# EAGLE design ABoatMon (EAGLE 9.3.0)
CNAME: MoteinoMega ABoatMon Shield; CREVISION: 0.959; DESIGNER: gregcope@gmail.com
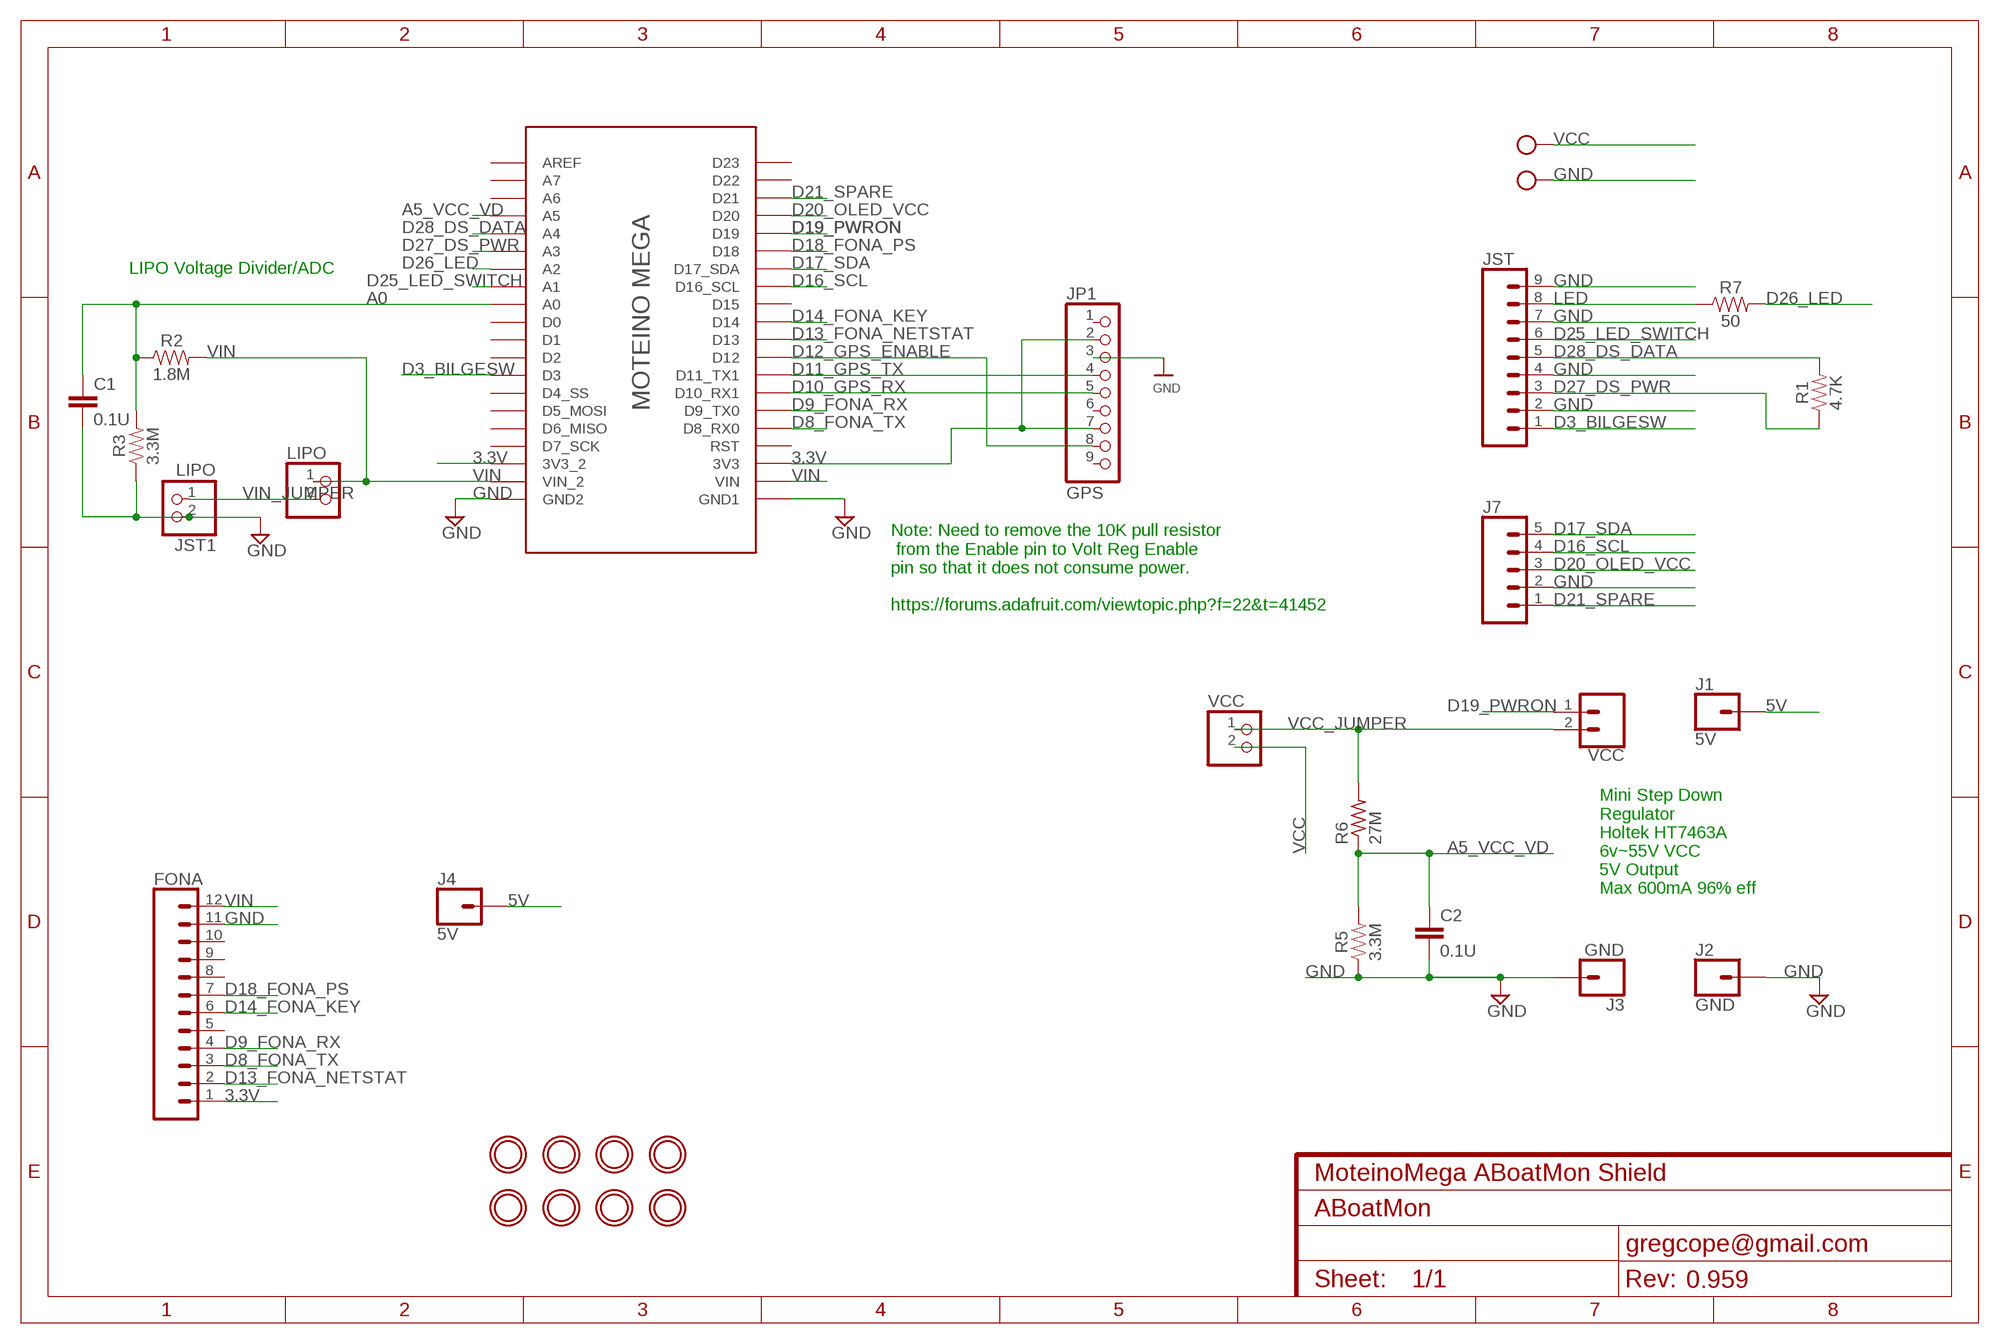
[diagram p0: schematic, sheet 1]

## Parts
C1  0.1U  0.1UF-KIT-EZ-50V-20%  [CAP-PTH-SMALL-KIT]
C2  0.1U  0.1UF-KIT-EZ-50V-20%  [CAP-PTH-SMALL-KIT]
ENABLE  VCC  CONN_02  [1X02]
FONA  CONN_12  [1X12]
GND  MOUNTINGHOLE2.5  [MOUNTINGHOLE_2.5_PLATED]
J1  5V  CONN_01  [1X01]
J2  GND  CONN_01  [1X01]
J3  GND  CONN_01  [1X01]
J4  5V  CONN_01  [1X01]
J7  CONN_05NO_SILK  [1X05_NO_SILK]
JP1  GPS  HEADER-1X970MIL  [1X09_ROUND_70]
JST  CONN_09  [1X09]
JST1  LIPO  JST_2PIN-THM  [JST-PH-2-THM]
LIPO  HEADER-1X2ROUND  [1X02_ROUND]
MOTEINO_MEGA  HEADERS  MOTEINO_MEGA_SIMPLE  [MOTEINO_MEGA_SIMPLE]
R1  4.7K  1KOHM-HORIZ-1/4W-1%  [AXIAL-0.3]
R2  1.8M  1KOHM-HORIZ-1/4W-1%  [AXIAL-0.3]
R3  3.3M  1KOHM-HORIZ-1/4W-1%  [AXIAL-0.3]
R5  3.3M  1KOHM-HORIZ-1/4W-1%  [AXIAL-0.3]
R6  27M  R-US_0309/12  [0309/12]
R7  50  1KOHM-HORIZ-1/4W-1%  [AXIAL-0.3]
U$1  MOUNTINGHOLE2.5  [MOUNTINGHOLE_2.5_PLATED]
U$2  MOUNTINGHOLE2.5  [MOUNTINGHOLE_2.5_PLATED]
U$3  MOUNTINGHOLE2.5  [MOUNTINGHOLE_2.5_PLATED]
U$4  MOUNTINGHOLE2.5  [MOUNTINGHOLE_2.5_PLATED]
U$5  MOUNTINGHOLE2.5  [MOUNTINGHOLE_2.5_PLATED]
U$7  MOUNTINGHOLE2.5  [MOUNTINGHOLE_2.5_PLATED]
U$8  MOUNTINGHOLE2.5  [MOUNTINGHOLE_2.5_PLATED]
VCC  HEADER-1X2ROUND  [1X02_ROUND]
X1  MKDSN1,5/2-5,08  [MKDSN1,5/2-5,08]

## Nets
3.3V [power]: FONA.1 JP1.2 JP1.7 MOTEINO_MEGA.3V3 MOTEINO_MEGA.3V3_2
5V [power]: J1.1 J4.1
A0: C1.1 MOTEINO_MEGA.A0 R2.P$1 R3.P$2
A5_VCC_VD: C2.1 MOTEINO_MEGA.A5 R5.P$2 R6.1
D3_BILGESW: JST.1 MOTEINO_MEGA.D3
D8_FONA_TX: FONA.3 MOTEINO_MEGA.D8(D8_RX0)
D9_FONA_RX: FONA.4 MOTEINO_MEGA.D9(D9_TX0)
D10_GPS_RX: JP1.5 MOTEINO_MEGA.D10(D10_RX1)
D11_GPS_TX: JP1.4 MOTEINO_MEGA.D11(D11_TX1)
D12_GPS_ENABLE: JP1.8 MOTEINO_MEGA.D12
D13_FONA_NETSTAT: FONA.2 MOTEINO_MEGA.D13
D14_FONA_KEY: FONA.6 MOTEINO_MEGA.D14
D16_SCL: J7.4 MOTEINO_MEGA.D16(D16_SCL)
D17_SDA: J7.5 MOTEINO_MEGA.D17(D17_SDA)
D18_FONA_PS: FONA.7 MOTEINO_MEGA.D18
D19_PWRON: ENABLE.1 MOTEINO_MEGA.D19
D20_OLED_VCC: J7.3 MOTEINO_MEGA.D20
D21_SPARE: J7.1 MOTEINO_MEGA.D21
D25_LED_SWITCH: JST.6 MOTEINO_MEGA.A1
D26_LED: MOTEINO_MEGA.A2 R7.P$2
D27_DS_PWR: JST.3 MOTEINO_MEGA.A3 R1.P$1
D28_DS_DATA: JST.5 MOTEINO_MEGA.A4 R1.P$2
GND [power]: C1.2 C2.2 FONA.11 J2.1 J3.1 J7.2 JP1.3 JST1.2 JST.2 JST.4 JST.7 JST.9 MOTEINO_MEGA.GND1 MOTEINO_MEGA.GND_2(GND2) R3.P$1 R5.P$1 X1.2
LED: JST.8 R7.P$1
VCC [power]: VCC.2 X1.1
VCC_JUMPER [power]: ENABLE.2 R6.2 VCC.1
VIN [power]: FONA.12 LIPO.1 MOTEINO_MEGA.VIN MOTEINO_MEGA.VIN_2 R2.P$2
VIN_JUMPER [power]: JST1.1 LIPO.2
Unconnected: FONA.5 FONA.8 FONA.9 FONA.10 JP1.1 JP1.6 JP1.9 MOTEINO_MEGA.A6 MOTEINO_MEGA.A7 MOTEINO_MEGA.AREF MOTEINO_MEGA.D0 MOTEINO_MEGA.D1 MOTEINO_MEGA.D2 MOTEINO_MEGA.D4(D4_SS) MOTEINO_MEGA.D5(D5_MOSI) MOTEINO_MEGA.D6(D6_MISO) MOTEINO_MEGA.D7(D7_SCK) MOTEINO_MEGA.D15 MOTEINO_MEGA.D22 MOTEINO_MEGA.D23 MOTEINO_MEGA.RST

## Notes on the sheet
- LIPO Voltage Divider/ADC
- Note: Need to remove the 10K pull resistor
   from the Enable pin to Volt Reg Enable 
  pin so that it does not consume power.
  
  https://forums.adafruit.com/viewtopic.php?f=22&t=41452
- Mini Step Down 
  Regulator
  Holtek HT7463A
  6v~55V VCC
  5V Output
  Max 600mA 96% eff

## Library data of the parts
C1 C2 = SparkFun-Capacitors:0.1UF: 0.1µF ceramic capacitors A capacitor is a passive two-terminal electrical component used to store electrical energy temporarily in an electric field.; PROD_ID: CAP-08370; VALUE: 0.1uF
ENABLE = SparkFun-Connectors:CONN_02: Multi connection point. Often used as Generic Header-pin footprint for 0.1 inch spaced/style header connections On any of the 0.1 inch spaced packages, you can populate with these: Break Away Headers - Straight <https://www.sparkfun.com/products/116> (PRT-00116) Break Away Male Headers - Right Angle <https://www.sparkfun.com/products/553> (PRT-00553) Female Headers <https://www.sparkfun.com/products/115> (PRT-00115) Break Away Headers - Machine Pin <https://www.sparkfun.com/products/117> (PRT-00117) Break Away Female Headers - Swiss Machine Pin <https://www.sparkfun.com/products/743> (PRT-00743) For SCREWTERMINALS and SPRING TERMINALS visit here: Screw Terimnals on SparkFun.com <https://www.sparkfun.com/search/results?term=Screw+Terminals> (5mm/3.5mm/2.54mm spacing) This device is also useful as a general connection point to wire up your design to another part of your project. Our various solder wires solder well into these plated through hole pads. Hook-Up Wire - Assortment (Stranded, 22 AWG) <https://www.sparkfun.com/products/11375> (PRT-11375) Hook-Up Wire - Assortment (Solid Core, 22 AWG) <https://www.sparkfun.com/products/11367> (PRT-11367) View the entire wire category on our website here <https://www.sparkfun.com/categories/141> Special notes: Molex polarized connector foot print use with: PRT-08233 with associated crimp pins and housings. 2.54_SCREWTERM for use with PRT-10571. 3.5mm Screw Terminal footprints for PRT-08084 5mm Screw Terminal footprints for use with PRT-08432
FONA = SparkFun-Connectors:CONN_12: Multi connection point. Often used as Generic Header-pin footprint for 0.1 inch spaced/style header connections On any of the 0.1 inch spaced packages, you can populate with these: Break Away Headers - Straight <https://www.sparkfun.com/products/116> (PRT-00116) Break Away Male Headers - Right Angle <https://www.sparkfun.com/products/553> (PRT-00553) Female Headers <https://www.sparkfun.com/products/115> (PRT-00115) Break Away Headers - Machine Pin <https://www.sparkfun.com/products/117> (PRT-00117) Break Away Female Headers - Swiss Machine Pin <https://www.sparkfun.com/products/743> (PRT-00743) For SCREWTERMINALS and SPRING TERMINALS visit here: Screw Terimnals on SparkFun.com <https://www.sparkfun.com/search/results?term=Screw+Terminals> (5mm/3.5mm/2.54mm spacing) This device is also useful as a general connection point to wire up your design to another part of your project. Our various solder wires solder well into these plated through hole pads. Hook-Up Wire - Assortment (Stranded, 22 AWG) <https://www.sparkfun.com/products/11375> (PRT-11375) Hook-Up Wire - Assortment (Solid Core, 22 AWG) <https://www.sparkfun.com/products/11367> (PRT-11367) View the entire wire category on our website here <https://www.sparkfun.com/categories/141> Special notes: Molex polarized connector foot print use with SKU : PRT-08231 with associated crimp pins and housings. 1MM SMD Version SKU: PRT-10208 NOTES ON THE VARIANTS LOCK and LOCK_LONGPADS... This footprint was designed to help hold the alignment of a through-hole component (i.e. 6-pin header) while soldering it into place. You may notice that each hole has been shifted either up or down by 0.005 of an inch from it's more standard position (which is a perfectly straight line). This slight alteration caused the pins (the squares in the middle) to touch the edges of the holes. Because they are alternating, it causes a "brace" to hold the component in place. 0.005 has proven to be the perfect amount of "off-center" position when using our standard breakaway headers. Although looks a little odd when you look at the bare footprint, once you have a header in there, the alteration is very hard to notice. Also,if you push a header all the way into place, it is covered up entirely on the bottom side.
GND U$1-U$5 U$7 U$8 = microbuilder:MOUNTINGHOLE: Mounting Hole For #2 screws (0.086"/2.18mm width, 0.094"/2.4mm hole) use 2.5mm
J1-J4 = SparkFun-Connectors:CONN_01: Single connection point. Often used as Generic Header-pin footprint for 0.1 inch spaced/style header connections On any of the 0.1 inch spaced packages, you can populate with these: Break Away Headers - Straight <https://www.sparkfun.com/products/116> (PRT-00116) Break Away Male Headers - Right Angle <https://www.sparkfun.com/products/553> (PRT-00553) Female Headers <https://www.sparkfun.com/products/115> (PRT-00115) Break Away Headers - Machine Pin <https://www.sparkfun.com/products/117> (PRT-00117) Break Away Female Headers - Swiss Machine Pin <https://www.sparkfun.com/products/743> (PRT-00743) This device is also useful as a general connection point to wire up your design to another part of your project. Our various solder wires solder well into these plated through hole pads. Hook-Up Wire - Assortment (Stranded, 22 AWG) <https://www.sparkfun.com/products/11375> (PRT-11375) Hook-Up Wire - Assortment (Solid Core, 22 AWG) <https://www.sparkfun.com/products/11367> (PRT-11367) View the entire wire category on our website here <https://www.sparkfun.com/categories/141> Special notes: SMTSO-256-ET is a "flush mount" nut for a 4-40 screw. We mostly use this on specialty testbeds; it is a nice way to connect hardware to your PCB at an adjustable hieght. Also note, the SNAP packages are for using a snappable style connector. We sell a baggie of snaps and they are also used on two LilyPad designs: Snap Assortment - 30 pack (male and female) <https://www.sparkfun.com/products/11347> (DEV-11347) LilyPad Arduino SimpleSnap <https://www.sparkfun.com/products/10941> (DEV-10941) LilyPad SimpleSnap Protoboard <https://www.sparkfun.com/products/10940> (DEV-10940)
J7 = SparkFun-Connectors:CONN_05: Multi connection point. Often used as Generic Header-pin footprint for 0.1 inch spaced/style header connections On any of the 0.1 inch spaced packages, you can populate with these: Break Away Headers - Straight <https://www.sparkfun.com/products/116> (PRT-00116) Break Away Male Headers - Right Angle <https://www.sparkfun.com/products/553> (PRT-00553) Female Headers <https://www.sparkfun.com/products/115> (PRT-00115) Break Away Headers - Machine Pin <https://www.sparkfun.com/products/117> (PRT-00117) Break Away Female Headers - Swiss Machine Pin <https://www.sparkfun.com/products/743> (PRT-00743) For SCREWTERMINALS and SPRING TERMINALS visit here: Screw Terimnals on SparkFun.com <https://www.sparkfun.com/search/results?term=Screw+Terminals> (5mm/3.5mm/2.54mm spacing) This device is also useful as a general connection point to wire up your design to another part of your project. Our various solder wires solder well into these plated through hole pads. Hook-Up Wire - Assortment (Stranded, 22 AWG) <https://www.sparkfun.com/products/11375> (PRT-11375) Hook-Up Wire - Assortment (Solid Core, 22 AWG) <https://www.sparkfun.com/products/11367> (PRT-11367) View the entire wire category on our website here <https://www.sparkfun.com/categories/141> Special notes: Molex polarized connector foot print use with SKU : PRT-08231 with associated crimp pins and housings. 1MM SMD Version SKU: PRT-10208
JP1 = microbuilder:HEADER-1X9: PIN HEADER
JST = SparkFun-Connectors:CONN_09: Multi connection point. Often used as Generic Header-pin footprint for 0.1 inch spaced/style header connections On any of the 0.1 inch spaced packages, you can populate with these: Break Away Headers - Straight <https://www.sparkfun.com/products/116> (PRT-00116) Break Away Male Headers - Right Angle <https://www.sparkfun.com/products/553> (PRT-00553) Female Headers <https://www.sparkfun.com/products/115> (PRT-00115) Break Away Headers - Machine Pin <https://www.sparkfun.com/products/117> (PRT-00117) Break Away Female Headers - Swiss Machine Pin <https://www.sparkfun.com/products/743> (PRT-00743) For SCREWTERMINALS and SPRING TERMINALS visit here: Screw Terimnals on SparkFun.com <https://www.sparkfun.com/search/results?term=Screw+Terminals> (5mm/3.5mm/2.54mm spacing) This device is also useful as a general connection point to wire up your design to another part of your project. Our various solder wires solder well into these plated through hole pads. Hook-Up Wire - Assortment (Stranded, 22 AWG) <https://www.sparkfun.com/products/11375> (PRT-11375) Hook-Up Wire - Assortment (Solid Core, 22 AWG) <https://www.sparkfun.com/products/11367> (PRT-11367) View the entire wire category on our website here <https://www.sparkfun.com/categories/141> Special notes: Molex polarized connector foot print use with SKU : PRT-08231 with associated crimp pins and housings. 1MM SMD Version SKU: PRT-10208 NOTES ON THE VARIANTS LOCK and LOCK_LONGPADS... This footprint was designed to help hold the alignment of a through-hole component (i.e. 6-pin header) while soldering it into place. You may notice that each hole has been shifted either up or down by 0.005 of an inch from it's more standard position (which is a perfectly straight line). This slight alteration caused the pins (the squares in the middle) to touch the edges of the holes. Because they are alternating, it causes a "brace" to hold the component in place. 0.005 has proven to be the perfect amount of "off-center" position when using our standard breakaway headers. Although looks a little odd when you look at the bare footprint, once you have a header in there, the alteration is very hard to notice. Also,if you push a header all the way into place, it is covered up entirely on the bottom side.
JST1 = adafruit:JST_2PIN: JST 2-Pin Connectors of various flavors SMT-RA (S2B-PH-SM4) 4UConnector #17311 SMT (B2B-PH-SM4) THM-RA (S2B-PH) THM (B2B-PH)
LIPO VCC = microbuilder:HEADER-1X2: PIN HEADER
MOTEINO_MEGA = Moteino:MOTEINO_MEGA_SIMPLE
R1-R3 R5 R7 = SparkFun-Resistors:1KOHM: 1kΩ resistor A resistor is a passive two-terminal electrical component that implements electrical resistance as a circuit element. Resistors act to reduce current flow, and, at the same time, act to lower voltage levels within circuits. - Wikipedia; PROD_ID: RES-12182; VALUE: 1k
R6 = adafruit:R-US_: RESISTOR, American symbol
X1 = con-phoenix-508:MKDSN1,5/2-5,08: MKDSN 1,5/ 2-5,08 Printklemme Nennstrom: 13,5 A Nennspannung: 250 V Rastermaß: 5,08 mm Polzahl: 2 Anschlussart: Schraubanschluss Montage: Löten Anschlussrichtung Leiter/Platine: 0 ° Artikelnummer: 1729128 Source: http://eshop.phoenixcontact.com .. 1729128.pdf

## Net classes
0 default: width 0.61 mm, clearance 0.406 mm
1 power: width 0.61 mm, clearance 0.406 mm

## Board
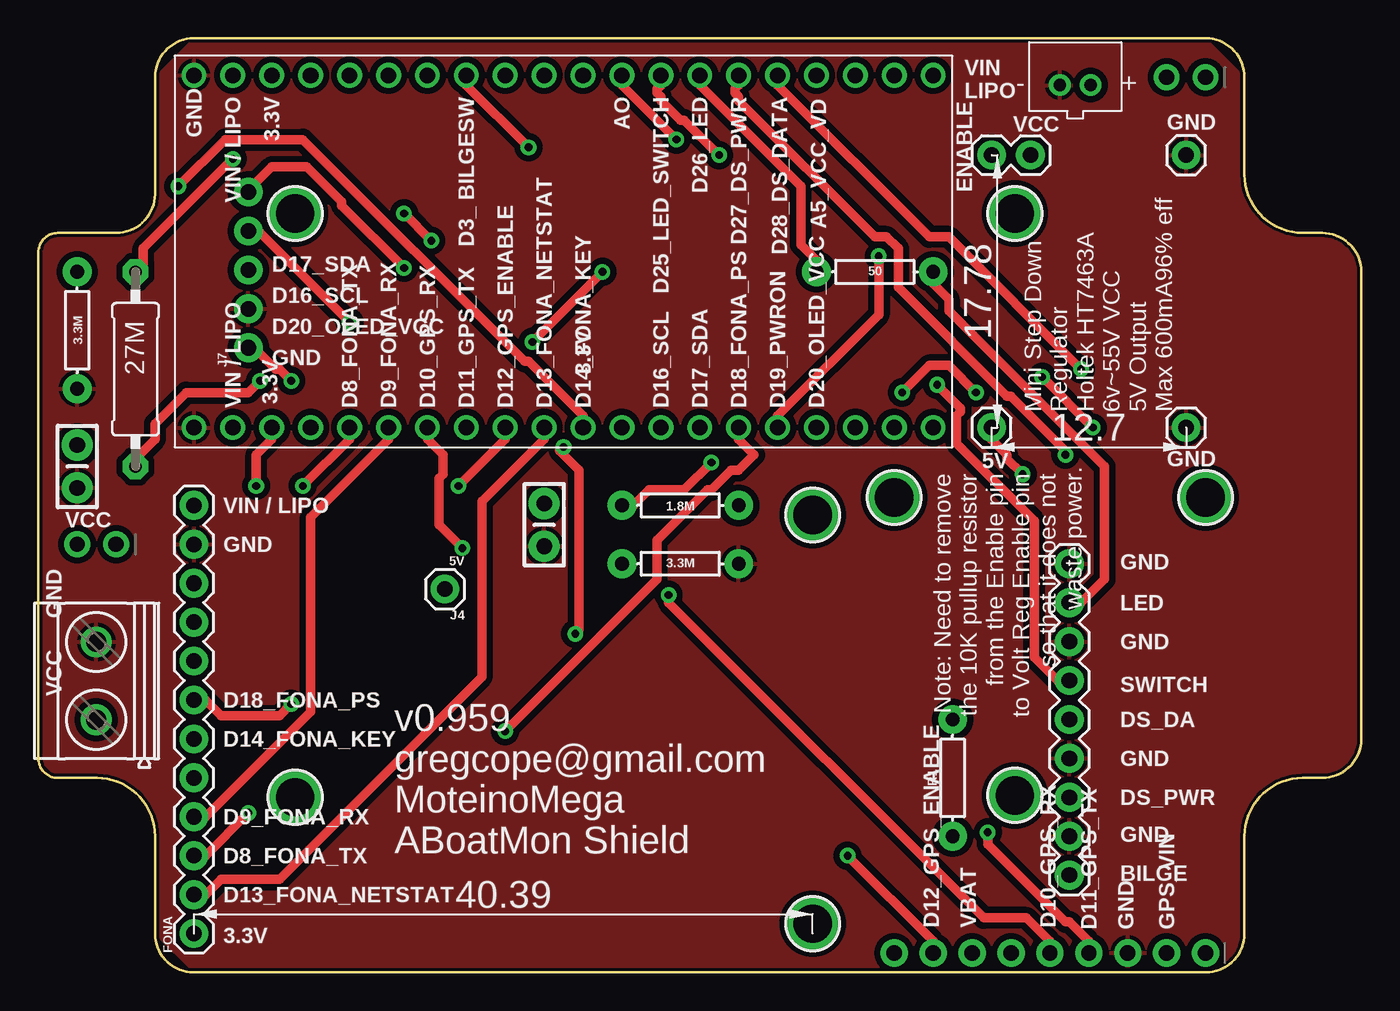
[diagram p1: board, top side]
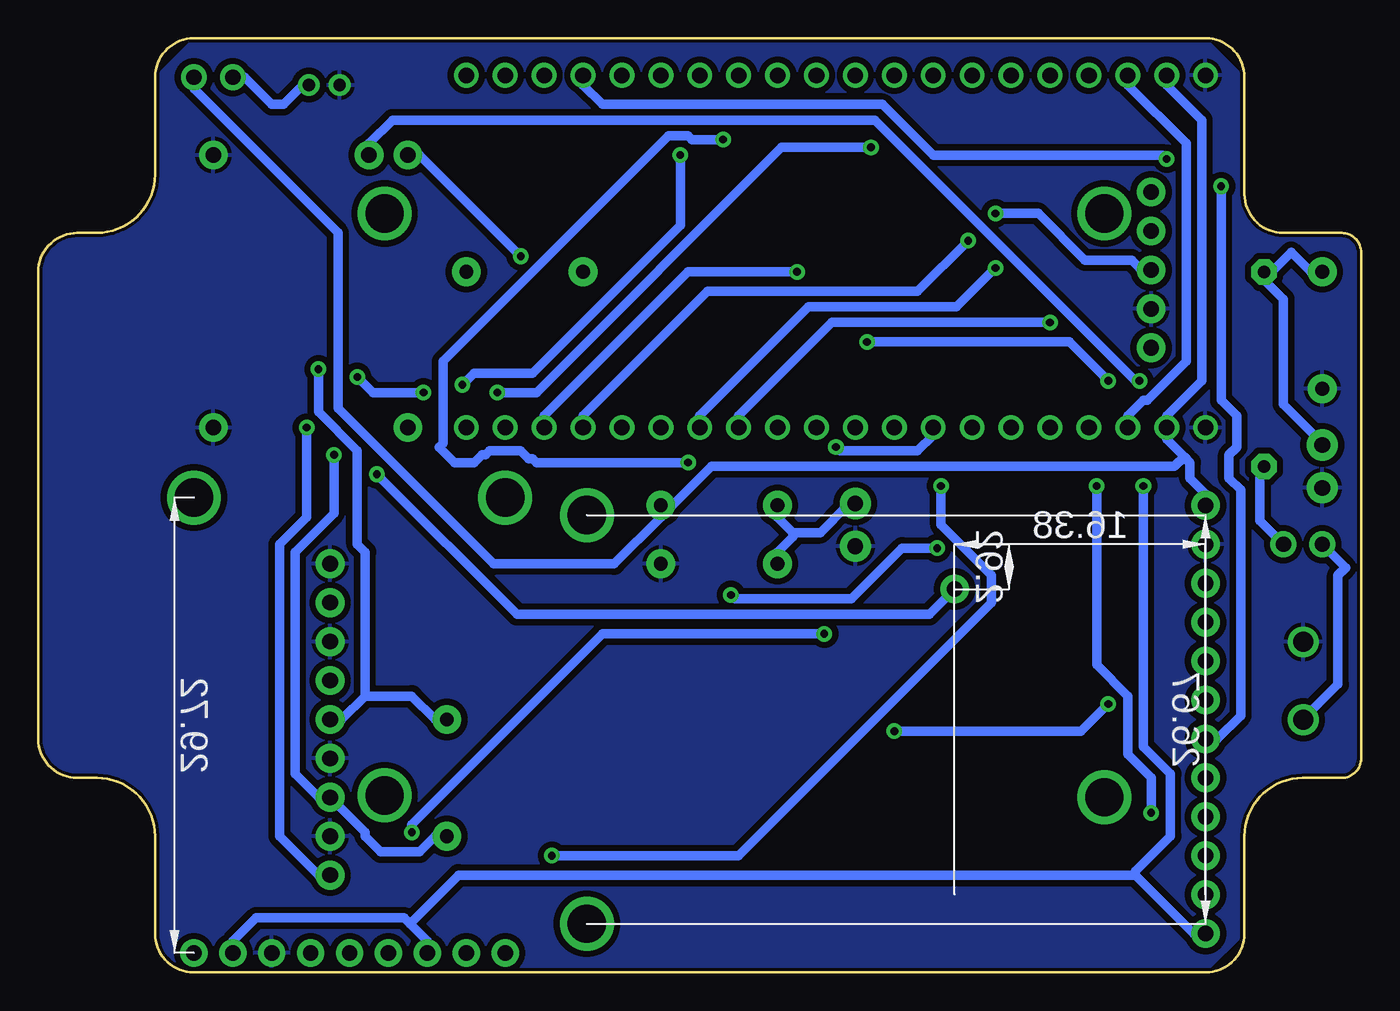
[diagram p2: board, bottom side, seen from below]

Size 86.36 x 60.96 mm. Coordinates in mm from the lower left corner, seen from the top.
Outline: 10.16,0 76.2,0 arc90 78.74,2.54 78.74,8.89 arc-90 82.55,12.7 83.82,12.7 arc90 86.36,15.24 86.36,45.72 arc90 83.82,48.26 82.55,48.26 arc-90 78.74,52.07 78.74,58.42 arc90 76.2,60.96 10.16,60.96 arc90 7.62,58.42 7.62,50.8 arc-90 5.08,48.26 1.27,48.26 arc90 0,46.99 0,13.97 arc90 1.27,12.7 3.81,12.7 arc-90 7.62,8.89 7.62,2.54 arc90 10.16,0
Copper layers (1*16): Top 0.035mm / dielectric 1.5mm / Bottom 0.035mm
Design rules "ABoatMon-2layer": minimum track width 10mil, minimum drill 20mil, track to track 10mil, track to pad 8mil, pad to pad 8mil, via to via 10mil, smd to smd 8mil, copper to edge 8mil, drill to drill 8mil, minimum pad ring 10mil, minimum via ring 10mil, stop-mask expansion 4mil, vias tented up to drill 25mil, thermal gap 10mil

### Footprints (pad centres in the part's own frame; a part is rotated, then mirrored left to right if it is on the bottom)
CAP-PTH-SMALL-KIT = drill 1.016 pad 2.032: 1 -1.397,0; 2 1.397,0
1X02 = drill 1.016 pad 1.88: 1 0,0; 2 2.54,0
1X12 = drill 1.016 pad 1.88: 1 0,0; 2 2.54,0; 3 5.08,0; 4 7.62,0; 5 10.16,0; 6 12.7,0; 7 15.24,0; 8 17.78,0; 9 20.32,0; 10 22.86,0; 11 25.4,0; 12 27.94,0
MOUNTINGHOLE_2.5_PLATED = drill 2.5 pad 3.2: P$1 0,0
1X01 = drill 1.016 pad 1.88: 1 0,0
1X05_NO_SILK = drill 1.016 pad 1.88: 1 0,0; 2 2.54,0; 3 5.08,0; 4 7.62,0; 5 10.16,0
1X09_ROUND_70 = drill 1 pad 1.778: 1 -10.16,0; 2 -7.62,0; 3 -5.08,0; 4 -2.54,0; 5 0,0; 6 2.54,0; 7 5.08,0; 8 7.62,0; 9 10.16,0
1X09 = drill 1.016 pad 1.88: 1 0,0; 2 2.54,0; 3 5.08,0; 4 7.62,0; 5 10.16,0; 6 12.7,0; 7 15.24,0; 8 17.78,0; 9 20.32,0
JST-PH-2-THM = drill 0.8 pad 1.422: 1 1,0; 2 -1,0
1X02_ROUND = drill 1 pad 1.676: 1 -1.27,0; 2 1.27,0
MOTEINO_MEGA_SIMPLE = drill 1.016 pad 1.626: 3V3 6.35,24.257; 3V3_2 6.35,1.27; A0 29.21,24.257; A1 31.75,24.257; A2 34.29,24.257; A3 36.83,24.257; A4 39.37,24.257; A5 41.91,24.257; A6 44.45,24.257; A7 46.99,24.257; AREF 49.53,24.257; D0 26.67,24.257; D1 24.13,24.257; D2 21.59,24.257; D3 19.05,24.257; D4 16.51,24.257; D5 13.97,24.257; D6 11.43,24.257; D7 8.89,24.257; D8 11.43,1.27; D9 13.97,1.27; D10 16.51,1.27; D11 19.05,1.27; D12 21.59,1.27; D13 24.13,1.27; D14 26.67,1.27; D15 29.21,1.27; D16 31.75,1.27; D17 34.29,1.27; D18 36.83,1.27; D19 39.37,1.27; D20 41.91,1.27; D21 44.45,1.27; D22 46.99,1.27; D23 49.53,1.27; GND1 1.27,24.257; GND_2 1.27,1.27; RST 8.89,1.27; VIN 3.81,24.257; VIN_2 3.81,1.27
AXIAL-0.3 = drill 0.9 pad 1.88: P$1 -3.81,0; P$2 3.81,0
0309/12 = drill 0.813 pad 1.676 octagon: 1 -6.35,0; 2 6.35,0
MKDSN1,5/2-5,08 = drill 1.3 pad 2: 1 -2.561,0.025; 2 2.519,0.025

### Placement (x,y rotation side)
C1  33.02,29.21 270 top
C2  2.54,33.02 270 top
ENABLE  62.23,53.34 0 top
FONA  10.16,2.54 90 top
GND  16.76,49.53 0 top
J1  62.23,35.56 0 top
J2  74.93,35.56 0 top
J3  74.93,53.34 0 top
J4  26.54,25.02 180 top
J7  13.72,40.77 90 top
JP1  66.04,1.27 180 top
JST  67.31,6.35 90 top
JST1  67.69,57.91 0 top
LIPO  74.93,58.42 180 top
MOTEINO_MEGA  8.89,34.29 0 top
R1  59.69,12.7 90 top
R2  41.91,30.48 0 top
R3  41.91,26.67 180 top
R5  2.54,41.91 90 top
R6  6.35,39.37 270 top
R7  54.61,45.72 180 top
U$1  16.76,11.43 0 top
U$2  50.55,3.17 180 top
U$3  55.88,30.99 180 top
U$4  50.55,29.84 180 top
U$5  76.2,30.99 180 top
U$7  63.75,49.53 0 top
U$8  63.75,11.56 0 top
VCC  3.81,27.94 180 top
X1  3.81,19.05 90 top

### Tracks (layer width: path | path; a pad name or v marks a point on that pad's centre or on a via)
3.3V  (via drill 0.51)
  Top 0.61: MOTEINO_MEGA.3V3_2 15.24,34.8 14.22,33.78 v14.22,31.75
  Bottom 0.61: MOTEINO_MEGA.3V3_2 15.24,36.32 14.22,37.34 13.97,37.34 11.43,39.88 11.43,54.1 15.24,57.91 MOTEINO_MEGA.3V3 | JP1.7 60.96,2.03 62.1,3.17 | 62.1,3.17 62.48,3.56 72.14,3.56 73.66,2.03 JP1.2 | FONA.1 10.92,2.54 14.73,6.35 | 14.73,6.35 58.93,6.35 62.1,3.17 | v14.22,31.75 14.22,14.73 12.45,12.95 12.45,8.89 14.73,6.6 14.73,6.35
5V  (via drill 0.51)
  Top 0.61: v64.26,32.51 63.25,33.53 63.25,33.78 62.23,34.8 J1.1
  Bottom 0.61: J4.1 28.19,23.37 55.12,23.37 v64.26,32.51
A0  (via drill 0.51)
  Top 0.61: MOTEINO_MEGA.A0 38.1,57.91 v41.66,54.36 | v43.94,33.27 42.16,31.5 39.88,31.5 38.86,30.48 R2.P$1
  Bottom 0.61: v41.66,54.36 43.69,54.36 43.94,54.61 45.21,54.61 59.94,39.88 59.94,34.54 60.2,34.29 59.18,33.27 57.91,33.27 57.4,33.78 57.15,33.78 56.9,34.04 54.86,34.04 54.36,33.53 54.1,33.53 53.85,33.27 v43.94,33.27 | R3.P$2 38.1,27.43 37.08,28.45 37.08,28.7 | 37.08,28.7 38.1,29.72 R2.P$1 | 37.08,28.7 35.31,28.7 33.53,30.48 33.02,30.48 C1.1
A5_VCC_VD  (via drill 0.51)
  Top 0.61: v12.7,53.09 6.86,47.24 6.86,46.23 R6.1
  Bottom 0.61: MOTEINO_MEGA.A5 50.8,57.91 49.53,56.64 31.24,56.64 27.94,53.34 12.95,53.34 v12.7,53.09 | R5.P$2 3.3,45.72 4.57,46.99 5.84,45.72 R6.1 6.35,45.21 5.08,43.94 5.08,37.08 2.54,34.54 C2.1
D3_BILGESW  (via drill 0.51)
  Top 0.61: MOTEINO_MEGA.D3 27.94,57.91 v32,53.85 | v56.39,37.85 58.17,39.62 59.44,39.62 v61.21,37.85 | v68.83,35.56 v65.53,38.86
  Bottom 0.61: v32,53.85 37.85,53.85 53.85,37.85 v56.39,37.85 | v61.21,37.85 64.52,37.85 v65.53,38.86 | v68.83,35.56 68.83,29.72 70.61,27.94 70.61,8.89 68.07,6.35 JST.1
D8_FONA_TX  (via drill 0.51)
  Top 0.61: MOTEINO_MEGA.D8 20.32,34.8 v17.27,31.75 | v13.72,10.41 10.92,7.62 FONA.3
  Bottom 0.61: v17.27,31.75 17.27,20.07 15.24,18.03 15.24,14.22 13.72,12.7 v13.72,10.41
D9_FONA_RX
  Top 0.61: MOTEINO_MEGA.D9 22.86,34.8 17.78,29.72 17.78,17.02 10.92,10.16 FONA.4
D10_GPS_RX  (via drill 0.51)
  Top 0.61: MOTEINO_MEGA.D10 25.4,34.8 26.42,33.78 26.42,32.51 26.16,32.26 26.16,29.21 v27.69,27.69 | v41.15,24.64 41.15,24.13 61.72,3.56 64.52,3.56 66.04,2.03 JP1.5
  Bottom 0.61: v27.69,27.69 29.97,27.69 33.27,24.38 40.89,24.38 v41.15,24.64
D11_GPS_TX  (via drill 0.51)
  Top 0.61: v34.29,34.29 34.04,34.04 35.31,32.77 35.31,22.35 v35.05,22.1 | v61.98,9.14 61.98,8.38 67.06,3.3 67.31,3.3 68.58,2.03 JP1.4
  Bottom 0.61: MOTEINO_MEGA.D11 27.94,35.05 28.96,34.04 34.04,34.04 v34.29,34.29 | v35.05,22.1 49.53,22.1 61.98,9.65 v61.98,9.14
D12_GPS_ENABLE  (via drill 0.51)
  Top 0.61: MOTEINO_MEGA.D12 30.48,34.8 v27.43,31.75 | v52.83,7.62 58.42,2.03 JP1.8
  Bottom 0.61: v27.43,31.75 27.43,29.21 24.13,25.91 24.13,24.13 40.64,7.62 v52.83,7.62
D13_FONA_NETSTAT
  Top 0.61: MOTEINO_MEGA.D13 33.02,34.8 28.96,30.73 28.96,19.3 15.75,6.1 11.94,6.1 10.92,5.08 FONA.2
D14_FONA_KEY  (via drill 0.51)
  Top 0.61: MOTEINO_MEGA.D14 35.56,36.32 32,39.88 31.75,39.88 17.27,54.36 12.19,54.36 v9.14,51.31
  Bottom 0.61: v9.14,51.31 9.14,37.34 8.13,36.32 8.13,34.29 8.64,33.78 8.64,32.26 7.87,31.5 7.87,16.76 9.4,15.24 FONA.6
D16_SCL  (via drill 0.51)
  Top 0.61: v20.32,42.42 14.48,48.26 13.72,48.26 J7.4
  Bottom 0.61: MOTEINO_MEGA.D16 40.64,36.32 34.54,42.42 v20.32,42.42
D17_SDA  (via drill 0.51)
  Top 0.61: v23.88,45.97 19.81,50.04 19.81,50.29 17.53,52.58 15.24,52.58 13.72,51.05 J7.5
  Bottom 0.61: MOTEINO_MEGA.D17 43.18,36.32 36.07,43.43 26.42,43.43 v23.88,45.97
D18_FONA_PS  (via drill 0.51)
  Top 0.61: MOTEINO_MEGA.D18 45.72,34.8 46.74,33.78 45.72,32.77 45.21,32.77 43.94,31.5 43.69,31.5 40.39,28.19 40.39,25.65 v30.48,15.75 | v16.51,17.53 15.75,16.76 11.94,16.76 10.92,17.78 FONA.7
  Bottom 0.61: v30.48,15.75 18.29,15.75 v16.51,17.53
D19_PWRON  (via drill 0.51)
  Top 0.61: MOTEINO_MEGA.D19 48.26,36.32 54.86,42.93 v54.86,46.74
  Bottom 0.61: v54.86,46.74 61.47,53.34 ENABLE.1
D20_OLED_VCC  (via drill 0.51)
  Top 0.61: v23.88,49.53 v25.65,47.75
  Bottom 0.61: MOTEINO_MEGA.D20 50.8,36.32 42.67,44.45 28.96,44.45 v25.65,47.75 | v23.88,49.53 21.08,49.53 18.03,46.48 14.99,46.48 14.48,45.97 13.72,45.97 J7.3
D21_SPARE  (via drill 0.51)
  Top 0.61: v32.26,41.15 v36.83,45.72 | v16.51,38.61 15.75,39.37 15.49,39.37 14.22,40.64 13.72,40.64 J7.1
  Bottom 0.61: MOTEINO_MEGA.D21 53.34,36.32 43.94,45.72 v36.83,45.72 | v32.26,41.15 19.05,41.15 v16.51,38.61
D25_LED_SWITCH  (via drill 0.51)
  Top 0.61: MOTEINO_MEGA.A1 40.64,57.91 40.39,57.66 40.39,57.4 40.64,57.15 40.64,56.9 41.91,55.63 42.16,55.63 v44.45,53.34 | v58.67,38.35 60.2,36.83 60.2,36.58 59.94,36.32 59.94,34.54 65.02,29.46 65.02,20.57 66.55,19.05 JST.6
  Bottom 0.61: v44.45,53.34 44.45,48.77 54.1,39.12 57.91,39.12 v58.67,38.35
D26_LED
  Top 0.61: MOTEINO_MEGA.A2 43.18,57.91 49.78,51.31 49.78,47.5 50.8,46.48 R7.P$2
D27_DS_PWR  (via drill 0.51)
  Top 0.61: MOTEINO_MEGA.A3 45.72,57.91 45.47,57.66 45.47,57.4 45.72,57.15 45.72,56.9 54.61,48.01 55.37,48.01 56.13,47.24 56.13,44.7 63.25,37.59 63.5,37.59 67.06,34.04 v67.06,33.78
  Bottom 0.61: v67.06,33.78 67.06,29.97 69.6,27.43 69.6,12.95 68.07,11.43 JST.3 65.02,9.14 65.02,8.89 64.01,7.87 61.47,7.87 60.45,8.89 R1.P$1
D28_DS_DATA  (via drill 0.51)
  Top 0.61: MOTEINO_MEGA.A4 48.26,57.91 58.17,48.01 59.44,48.01 v68.07,39.37
  Bottom 0.61: v68.07,39.37 68.07,36.58 65.53,34.04 65.53,27.94 65.02,27.43 65.02,18.03 | 65.02,18.03 66.55,16.51 JST.5 | R1.P$2 60.45,16.51 61.98,18.03 65.02,18.03
GND
  pour Top: 10.16,60.96 76.2,60.96 78.74,58.42 78.74,50.8 81.28,48.26 85.09,48.26 86.36,46.99 86.36,15.24 85.09,12.7 81.28,12.7 78.74,10.16 78.74,2.54 77.47,0 10.16,0 7.62,2.54 7.62,10.16 5.08,12.7 1.27,12.7 0,13.97 0,46.99 1.27,48.26 5.08,48.26 7.62,49.53 7.62,58.42
  pour Top: 10.16,60.96 76.2,60.96 78.74,58.42 78.74,50.8 81.28,48.26 85.09,48.26 86.36,46.99 86.36,15.24 85.09,12.7 81.28,12.7 78.74,10.16 78.74,2.54 77.47,0 10.16,0 7.62,2.54 7.62,10.16 5.08,12.7 1.27,12.7 0,13.97 0,46.99 1.27,48.26 5.08,48.26 7.62,49.53 7.62,58.42
  pour Bottom: 7.62,58.42 10.16,60.96 76.2,60.96 78.74,58.42 78.74,50.8 81.28,48.26 85.09,48.26 86.36,46.99 86.36,15.24 85.09,12.7 81.28,12.7 78.74,10.16 78.74,2.54 77.47,0 10.16,0 7.62,2.54 7.62,10.16 5.08,12.7 1.27,12.7 0,13.97 0,46.99 1.27,48.26 5.08,48.26 7.62,49.53
LED
  Top 0.61: JST.8 68.07,24.13 69.6,25.65 69.6,33.02 59.44,43.18 59.44,43.94 58.42,44.96 R7.P$1
VCC
  Bottom 0.61: VCC.2 1.02,26.42 1.52,25.91 1.52,18.8 3.81,16.51 X1.1
VCC_JUMPER  (via drill 0.51)
  Top 0.61: v14.48,38.61 13.72,37.85 9.65,37.85 7.62,35.81 7.62,34.8 6.35,33.53 R6.2
  Bottom 0.61: VCC.1 6.6,29.46 6.6,32.26 6.35,32.51 R6.2 | ENABLE.2 64.77,54.1 63.25,55.63 31.75,55.63 14.73,38.61 v14.48,38.61
VIN
  Bottom 0.61: 11.56,33.66 11.18,33.27 11.18,32.26 10.16,31.24 FONA.12 | 11.56,33.66 12.7,34.8 MOTEINO_MEGA.VIN_2 12.45,35.56 12.45,35.81 12.7,36.07 12.7,36.32 10.41,38.61 10.41,55.63 12.7,57.91 MOTEINO_MEGA.VIN | LIPO.1 76.2,57.66 66.8,48.26 66.8,36.83 56.64,26.67 48.77,26.67 45.72,29.72 R2.P$2 45.47,29.97 42.42,33.02 12.19,33.02 11.56,33.66
VIN_JUMPER
  Bottom 0.61: JST1.1 69.09,57.91 70.36,56.64 71.12,56.64 72.9,58.42 LIPO.2

### Text on the board
tNames: VIN / LIPO | 3.3V | D3_ BILGESW | AO | D25_LED_SWITCH | D26_LED | D27_DS_PWR | D28_DS_DATA | A5_VCC_VD | VIN / LIPO | GND | D17_SDA | D16_SCL | D20_OLED_VCC | 3.3V | GND | VIN / LIPO | 3.3V | D8_FONA_TX | D9_FONA_RX | D10_GPS_RX | D11_GPS_TX | D12_GPS_ENABLE | D13_FONA_NETSTAT | D14_FONA_KEY | D16_SCL | D17_SDA | D18_FONA_PS | D19_PWRON | D20_OLED_VCC | Mini Step Down / Regulator / Holtek HT7463A / 6v~55V VCC / 5V Output / Max 600mA96% eff | Note: Need to remove / the 10K pullup resistor / from the Enable pin / to Volt Reg Enable pin / so that it does not / waste power. | VIN / LIPO | GND | GND | LED | GND | GND | VCC | SWITCH | D18_FONA_PS | DS_DA | D14_FONA_KEY | GND | DS_PWR | D9_FONA_RX | GND | v0.959 / gregcope@gmail.com / MoteinoMega / ABoatMon Shield | D8_FONA_TX | BILGE | D13_FONA_NETSTAT | D12_GPS_ENABLE | VBAT | D10_GPS_RX | D11_GPS_TX | GND | GPS_VIN | 3.3V